# EAGLE design Current Controller (EAGLE 8.3.2)
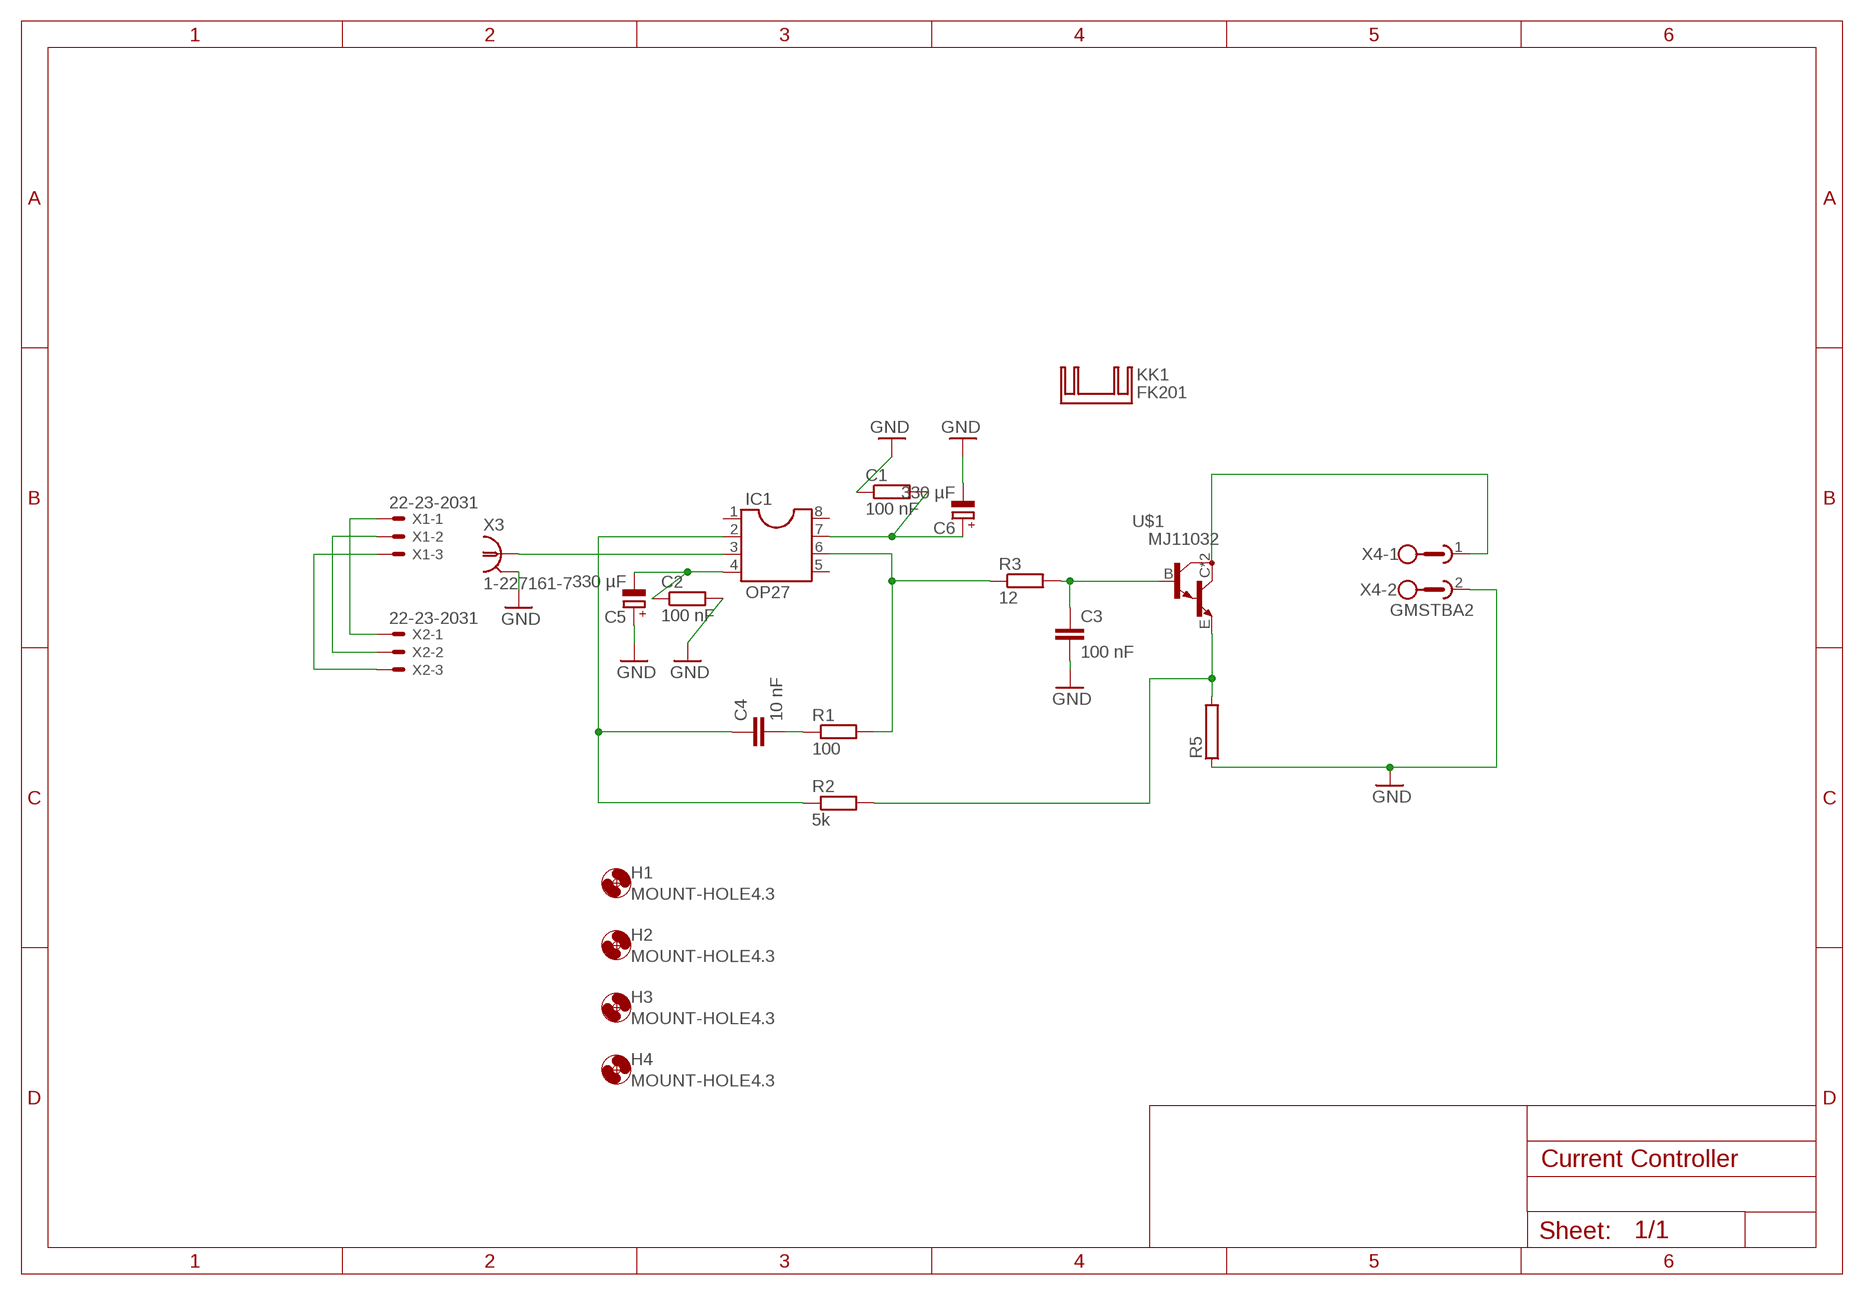
[diagram p0: schematic, sheet 1]

## Parts
C1  100 nF  R-EU_M1206  [M1206]
C2  100 nF  R-EU_M1206  [M1206]
C3  100 nF  C-EU025-050X050  [C025-050X050]
C4  10 nF  C-EU025-050X050  [C025-050X050]
C5  330 µF  CPOL-EUE5-8.5  [E5-8,5]
C6  330 µF  CPOL-EUE5-8.5  [E5-8,5]
H1  MOUNT-HOLE4.3  [4,3]
H2  MOUNT-HOLE4.3  [4,3]
H3  MOUNT-HOLE4.3  [4,3]
H4  MOUNT-HOLE4.3  [4,3]
IC1  OP27  DIL8  [DIL08]
KK1  FK201  [FK201]
R1  100  R-EU_0309/12  [0309/12]
R2  5k  R-EU_0309/12  [0309/12]
R3  12  R-EU_0309/12  [0309/12]
R5  RRWM10X64  [RWM10X64]
U$1  MJ11032  [TO3/]
X1  22-23-2031  [22-23-2031]
X2  22-23-2031  [22-23-2031]
X3  1-227161-7  [AMP_227161]
X4  GMSTBA2  [GMSTBA2]

## Nets
-IN: C4.1 IC1.2 R2.1
BASE_VOLTAGE: C3.1 R3.2 U$1.B
CURRENT_IN: U$1.C U$1.C/(C) X4.1
GND: C1.1 C2.2 C3.2 C5.+ C6.- R5.1 X1.2 X2.2 X3.2 X4.2
N$3: R2.2 R5.2 U$1.E
N$5: C4.2 R1.1
OPAMP_OUT: IC1.6 R1.2 R3.1
SIG_IN: IC1.3 X3.1
V+: C1.2 C6.+ IC1.7 X1.1 X2.1
V-: C2.1 C5.- IC1.4 X1.3 X2.3
Unconnected: IC1.1 IC1.5 IC1.8

## Library data of the parts
C1 C2 = rcl:R-EU_: RESISTOR, European symbol
C3 C4 = resistor:C-EU: CAPACITOR, European symbol
C5 C6 = resistor:CPOL-EU: POLARIZED CAPACITOR, European symbol
H1-H4 = holes:MOUNT-HOLE: MOUNTING HOLE with drill center marker
IC1 = ic-package:DIL8: Dual In Line / Socket
KK1 = heatsink:FK201: HEATSINK manufacturer Fischer/distributor Buerklin
R1-R3 = resistor:R-EU_: RESISTOR, European symbol
R5 = resistor-power:R: Power Resitor; OC_FARNELL: unknown; OC_NEWARK: unknown
U$1 = Current Controller:MJ11032
X1 X2 = con-molex:22-23-2031: .100" (2.54mm) Center Header - 3 Pin; MF: MOLEX; MPN: 22-23-2031; OC_FARNELL: 1462950; OC_NEWARK: 30C0862
X3 = con-coax:?227161*: JACK, RIGHT ANGLE, 50 OHM, PCB, BNC Source: amp_227161.pdf; MF: TYCO ELECTRONICS; MPN: 1-227161-7; OC_FARNELL: unknown; OC_NEWARK: 09H7855
X4 = con-phoenix-762:GMSTBA2: PHOENIX; MF: FARNELL; MPN: 1757242; OC_FARNELL: 3705171; OC_NEWARK: 71C4161

## Board
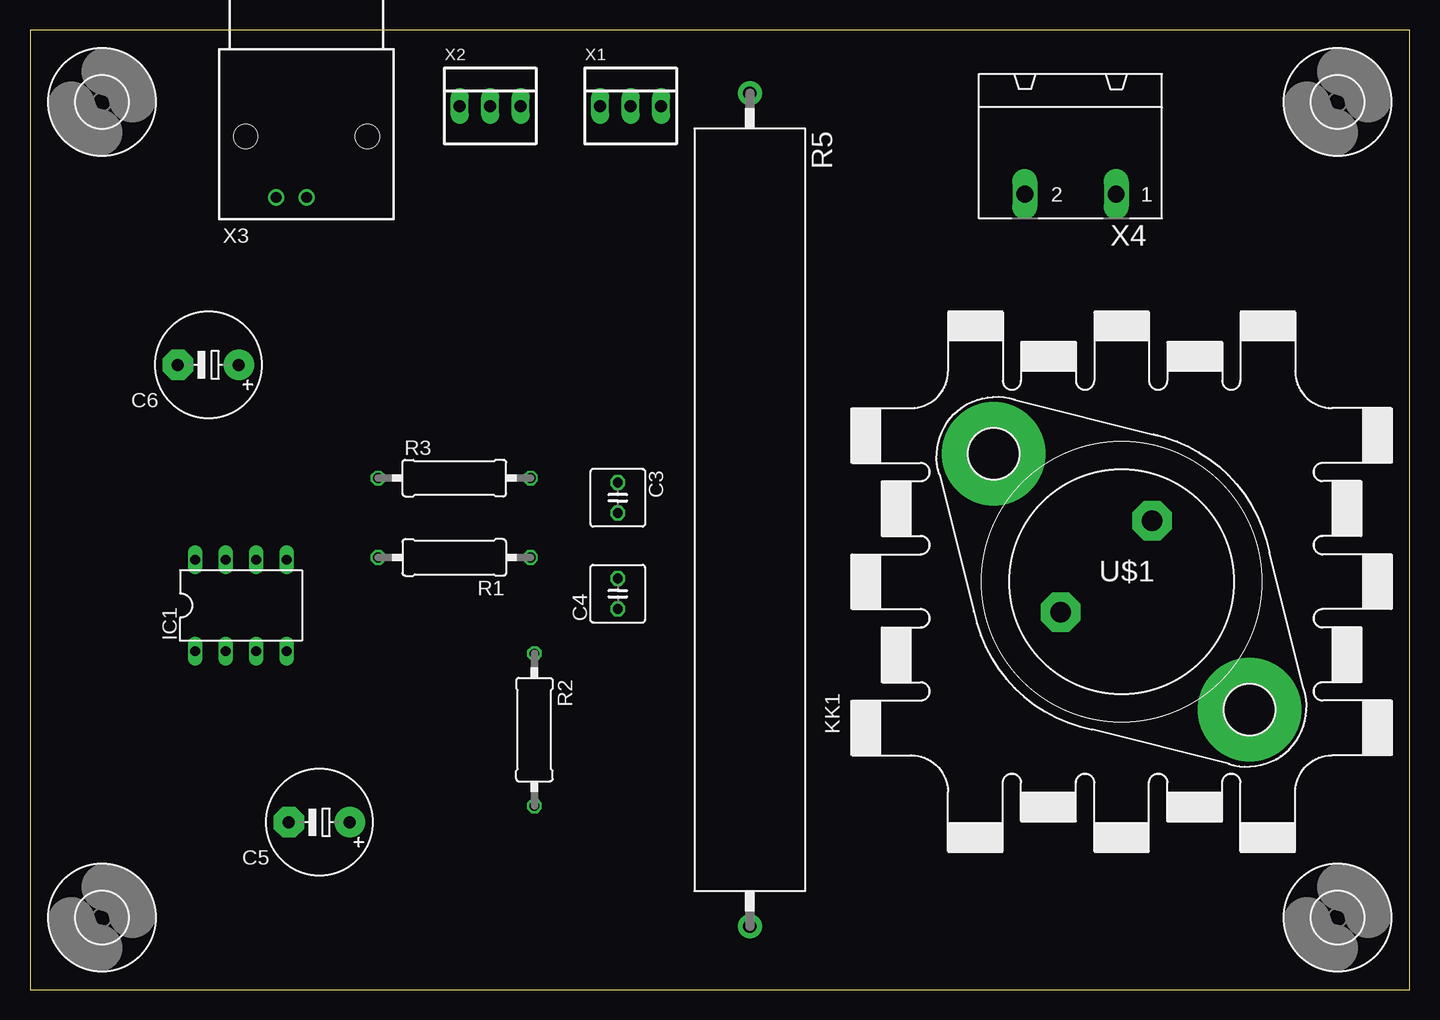
[diagram p1: board, top side]
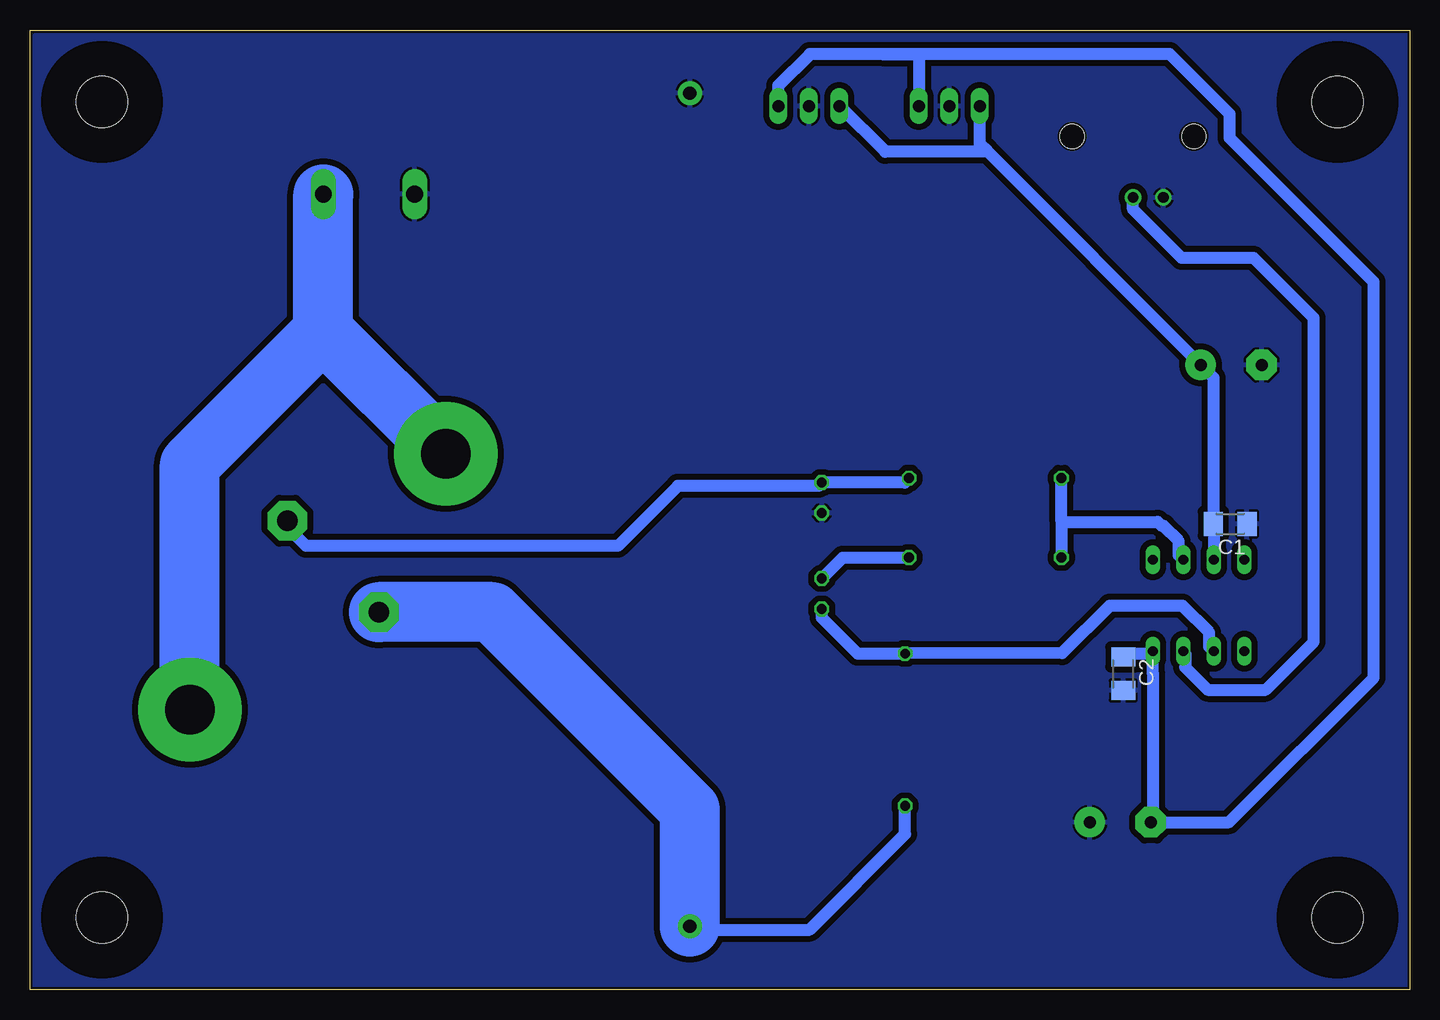
[diagram p2: board, bottom side, seen from below]

Size 115 x 80 mm. Coordinates in mm from the lower left corner, seen from the top.
Outline: 0,0 115,0 115,80 0,80 0,0
Copper layers 16: Bottom 0.035mm
Design rules "Multi-CB_1L_125um-Tracks_OL35um *": minimum track width 0.125mm, minimum drill 0.2mm, track to track 0.5mm, track to pad 0.5mm, pad to pad 0.5mm, via to via 0.5mm, smd to smd 0mil, copper to edge 0.2mm, drill to drill 0.2mm, minimum pad ring 0.125mm, minimum via ring 0.125mm, stop-mask expansion 2mil, vias tented up to drill 0.45mm, thermal gap 0.2mm

### Footprints (pad centres in the part's own frame; a part is rotated, then mirrored left to right if it is on the bottom)
M1206 = smd 1.6 x 2: 1 -1.4,0; 2 1.4,0
C025-050X050 = drill 0.813 octagon: 1 -1.27,0; 2 1.27,0
E5-8,5 = drill 1.016 pad 2.54: + -2.54,0 | drill 1.016 pad 2.54 octagon: - 2.54,0
4,3 = hole 4.3: 0,0
DIL08 = drill 0.813 long: 1 -3.81,-3.81; 2 -1.27,-3.81; 3 1.27,-3.81; 4 3.81,-3.81; 5 3.81,3.81; 6 1.27,3.81; 7 -1.27,3.81; 8 -3.81,3.81
0309/12 = drill 0.813 octagon: 1 -6.35,0; 2 6.35,0
RWM10X64 = drill 1.1 pad 2: 1 -34.74,0; 2 34.74,0
TO3/ = drill 1.727 pad 3.302 octagon: B 2.54,5.08; E -5.08,-2.54 | drill 4.115 pad 8.636: C 10.668,-10.668; C/ -10.668,10.668
22-23-2031 = drill 1 long: 1 -2.54,0; 2 0,0; 3 2.54,0
AMP_227161 = drill 0.9 pad 1.27: 1 0,-5.08; 2 -2.54,-5.08 | hole 2: -5.08,0; 5.08,0
GMSTBA2 = drill 1.397 long: 1 -3.81,5.08; 2 3.81,5.08

### Placement (x,y rotation side)
C1  14.95,38.82 180 bottom
C2  23.86,26.33 270 bottom
C3  49,41 270 top
C4  49,33 90 top
C5  24.11,13.94 180 top
C6  14.86,52.07 180 top
H1  109,6 0 top
H2  6,74 0 top
H3  109,74 0 top
H4  6,6 0 top
IC1  17.59,32.02 0 top
KK1  91,34 0 top
R1  35.37,36.02 180 top
R2  42.05,21.66 270 top
R3  35.37,42.64 0 top
R5  60,40 270 top
U$1  91,34 0 top
X1  50.07,73.66 0 top
X2  38.37,73.66 0 top
X3  23.05,71.12 0 top
X4  86.74,71.39 180 top

### Tracks (layer width: path | path; a pad name or v marks a point on that pad's centre or on a via)
-IN
  Bottom 1: IC1.2 16.7,28.59 16.7,29.77 18.93,32 25,32 28.95,28.05 R2.1 46,28 49,31 C4.1
BASE_VOLTAGE
  Bottom 1: R3.2 42.09,42.27 C3.1 49.27,42 61,42 66,37 92,37 93.54,38.54 U$1.B
CURRENT_IN
  Bottom 5: 90.55,54.89 X4.1 | 90.55,54.89 U$1.C/ | U$1.C 101.67,43.77 90.55,54.89
GND
  pour Bottom: 0,0 115.33,0 115.33,78.74 114.06,80.01 0,80.01
N$3
  Bottom 1: R5.2 59.74,5 50,5 42.05,12.95 R2.2
  Bottom 5: R5.2 60,15 76.46,31.46 U$1.E
N$5
  Bottom 1: C4.2 47.25,36.02 R1.1
OPAMP_OUT
  Bottom 1: IC1.6 19.24,36.21 19.24,37.38 20.5,38.65 20.65,38.65 21,39 29,39 | 29,39 29.02,39.02 R3.1 | R1.2 29,36.04 29,39
SIG_IN
  Bottom 1: IC1.3 18.7,28.05 18.7,26.87 16.83,25 12,25 8,29 8,56 13,61 19,61 23.05,65.05 X3.1
V+
  Bottom 1: IC1.7 16.32,38.79 C1.2 16.35,51.02 C6.+ 35.16,69.83 | 35.16,69.83 35.83,70.5 X2.1 | 35.16,69.83 43.7,69.83 X1.1
V-
  Bottom 1: C2.1 23.86,27.86 24,28 21.61,28 IC1.4 21.4,26.39 21.36,26.35 21.36,14.15 C5.- 15.06,13.94 3,26 3,59 15,71 15,73 20,78 44,78 | X1.3 52.61,75.39 50,78 44,78 | X2.3 40.91,78 44,78